# EAGLE design Grove - Dry-Reed Relay v1.0b (EAGLE 6.3)
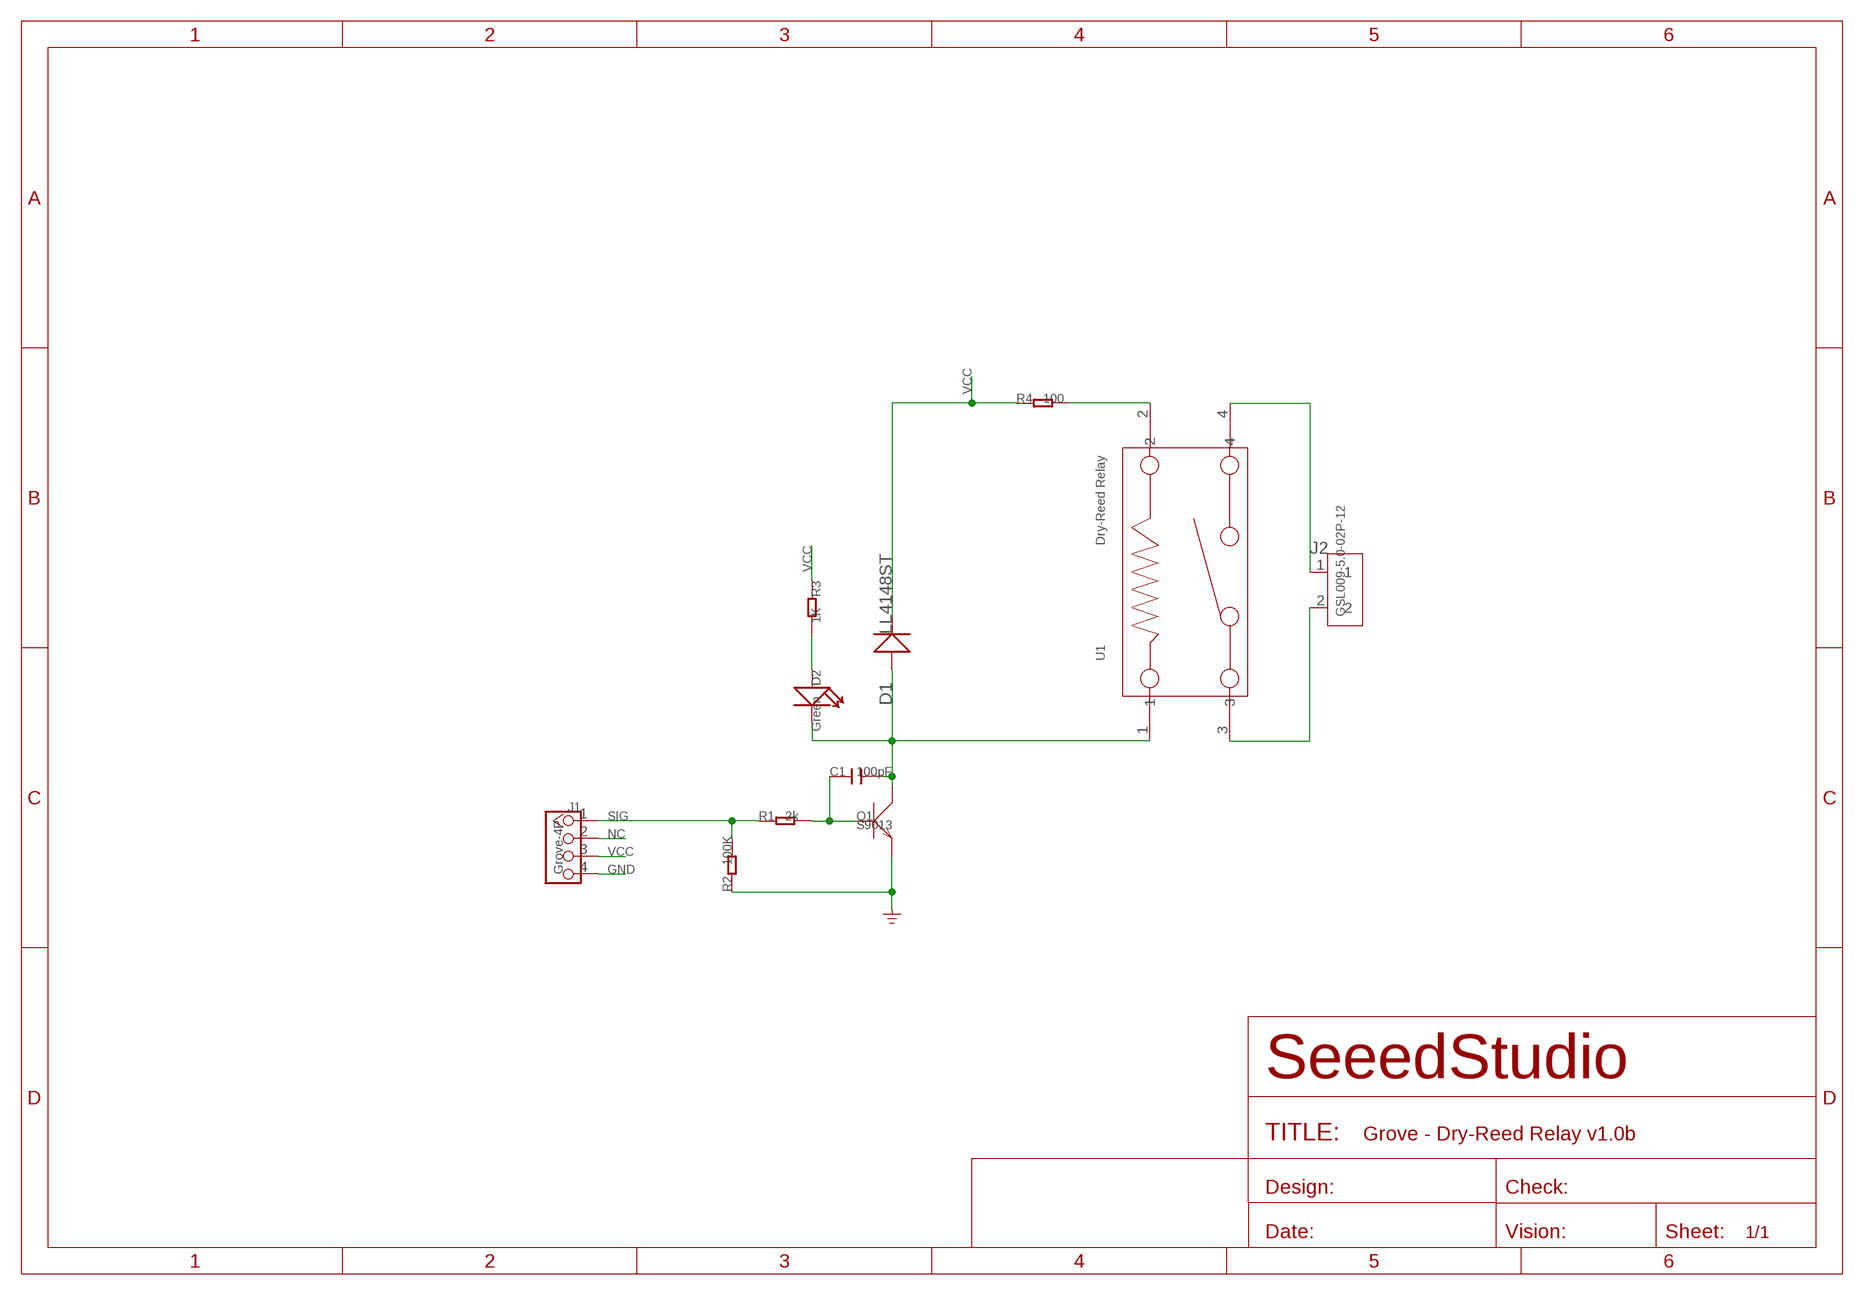
[diagram p0: schematic, sheet 1]

## Parts
C1  100pF  C-0603  [C0603]
D1  LL4148ST  D'1N4148-SMD'  [DO-35-SMD]
D2  Green  LED'0603'  [LED-0603]
J1  Grove-4P  TWIG-4P-2.0-2.0  [4P-2.0]
J2  GSL009-5.0-02P-12  SCREW-TERMINAL-2P'5.08'  [2P-5.08]
Q1  S9013  TRANSISTOR-NPN-SOT23  [SOT23]
R1  2k  R-0603  [R0603]
R2  100K  R-0603  [R0603]
R3  1K  R-0603  [R0603]
R4  100  R-0603  [R0603]
U1  Dry-Reed Relay  RELAY-BR'BR-500R-H-5VDC'  [4P-25.2X8X9H]

## Nets
GND: J1.4 Q1.2(E) R2.1
N$1: C1.1 Q1.1(B) R1.2
N$2: D2.+ R3.2
N$3: C1.2 D1.A(+) D2.- Q1.3(C) U1.1
N$4: J2.1 U1.4
N$6: J2.2 U1.3
N$7: R4.2 U1.2
NC: J1.2
SIG: J1.1 R1.1 R2.2
VCC: D1.C(-) J1.3 R3.1 R4.1

## Library data of the parts
C1 = Discrete:C*: Ceramic Capacitors
D1 = Discrete:D*
D2 = Discrete:LED*
J1 = Connector:TWIG-4P-2.0
J2 = Connector:SCREW-TERMINAL-2P
Q1 = Discrete:TRANSISTOR-NPN*: NPN audion
R1-R4 = Discrete:R*
U1 = template:RELAY-BR: • Small size, light weight and low cost • Application: Mainly use in Cordless Phone, Answering Machine and Security Alarm System etc.… • UL File No.E147052

## Board
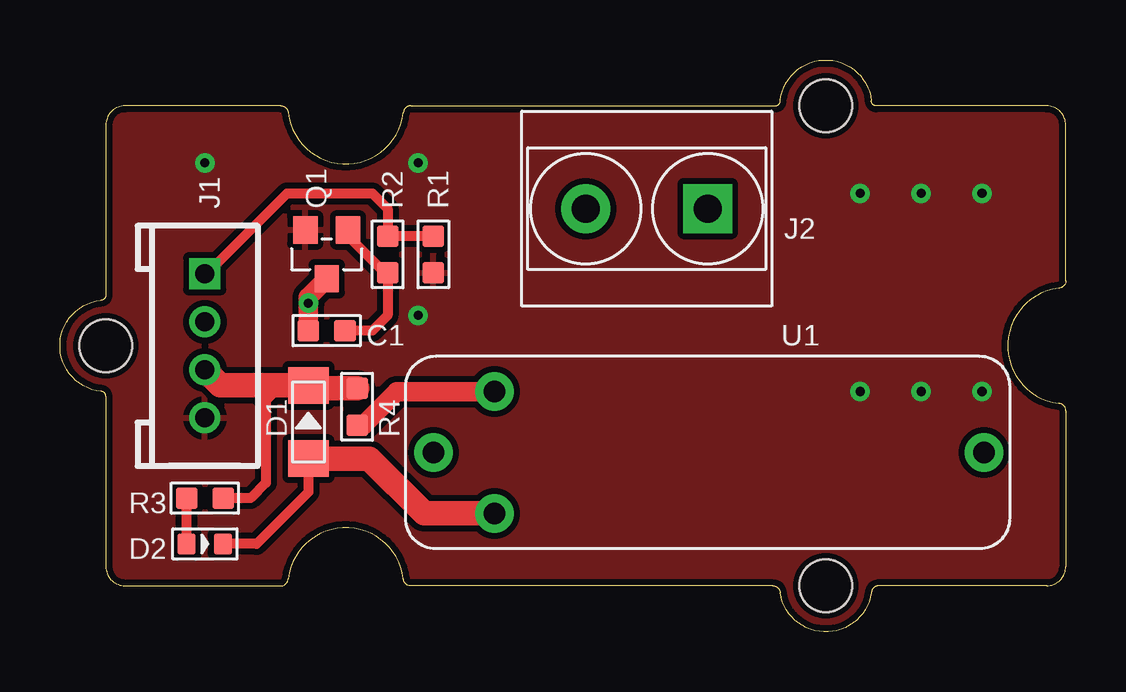
[diagram p1: board, top side]
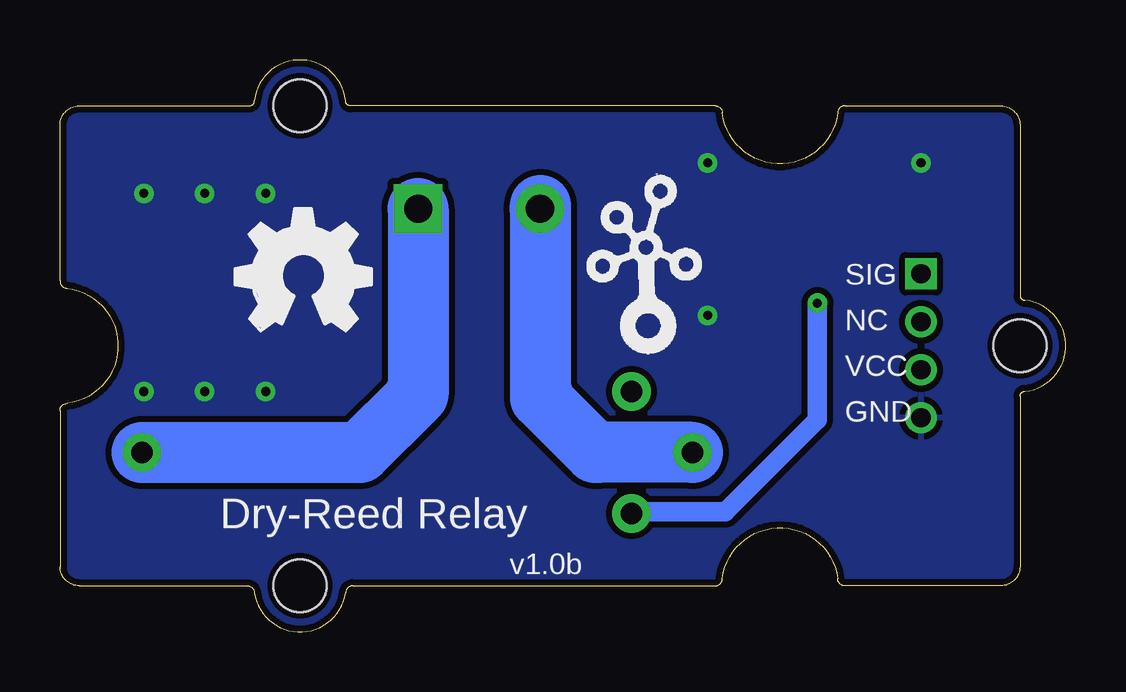
[diagram p2: board, bottom side, seen from below]

Size 41.91 x 23.83 mm. Coordinates in mm from the lower left corner, seen from the top.
Copper layers (1*16): Top 0.035mm / dielectric 1.5mm / Bottom 0.035mm
Design rules "SeeedStudio_rule_no_angle_090911": minimum track width 6mil, minimum drill 12mil, track to track 6mil, track to pad 6mil, pad to pad 6mil, via to via 6mil, smd to smd 0mil, copper to edge 10mil, drill to drill 10mil, minimum pad ring 10mil, minimum via ring 6mil, stop-mask expansion 2mil, vias tented up to drill 25mil, thermal gap 10mil

### Footprints (pad centres in the part's own frame; a part is rotated, then mirrored left to right if it is on the bottom)
C0603 = smd 0.889 x 0.889: 1 -0.762,0; 2 0.762,0
DO-35-SMD = smd 1.524 x 1.676: A -1.524,0; C 1.524,0
LED-0603 = smd 0.762 x 0.889: + -0.762,0; - 0.762,0
4P-2.0 = drill 0.8 pad 1.27 square: 1 -3,0 | drill 0.8 pad 1.27: 2 -1,0; 3 1,0; 4 3,0
2P-5.08 = drill 1.168 pad 2.032 square: 1 0,2.54 | drill 1.168 pad 2.032: 2 0,-2.54
SOT23 = smd 1.016 x 1.143: 1 -0.889,-1.016; 2 0.889,-1.016; 3 0,1.016
R0603 = smd 0.889 x 0.889: 1 -0.762,0; 2 0.762,0
4P-25.2X8X9H = drill 0.9 pad 1.6: 1 -8.89,-2.54; 2 -8.89,2.54; 3 -11.43,0; 4 11.51,0
2U-DIM-W/DRILL = hole 2.2: -10,-10; -10,10; 20,0

### Placement (x,y rotation side)
C1  11.11,12.56 180 top
D1  10.35,8.75 90 top
D2  6.03,3.67 0 top
J1  6.03,11.92 270 top
J2  24.45,17.64 270 top
Q1  11.11,15.73 180 top
R1  13.65,15.73 270 top
R2  15.56,15.73 90 top
R3  6.03,5.57 180 top
R4  12.38,9.38 270 top
U1  26.99,7.48 0 top
U$3  [2U-DIM-W/DRILL]  21.91,11.92 180 top
U$4  [OSHW_FILLX200_NOTEXT]  34.61,12.56 0 bottom
U$5  [TWIGLOGO]  17.46,12.56 0 bottom

### Tracks (layer width: path | path; a pad name or v marks a point on that pad's centre or on a via)
GND  (via drill 0.38 pad 0.81)
  other vias: 38.42,18.27 33.34,18.27 35.88,18.27 35.88,10.02 33.34,10.02 38.42,10.02 14.92,13.19 14.92,19.54 6.03,19.54
  pour Top (isolate 0.254): -0.32,-0.27 42.23,-0.14 42.23,23.99 -0.32,23.99
  pour Bottom (isolate 0.254): -0.32,-0.27 42.23,-0.27 42.23,23.86 -0.32,23.86
N$1
  Top 0.406: R1.2 13.65,14.84 | 13.65,14.84 13.65,13.19 13.02,12.56 C1.1 | Q1.1 12,16.49 13.65,14.84
N$2
  Top 0.406: D2.+ R3.2
N$3  (via drill 0.38 pad 0.81)
  Top 0.406: 10.48,7.22 10.35,7.1 10.35,5.83 8.19,3.67 D2.-
  Top 0.813: Q1.3 10.35,13.95 C1.2 v10.35,13.7
  Top 1.016: D1.A 10.48,7.22 12.89,7.22 15.18,4.94 U1.1
  Bottom 0.813: v10.35,13.7 10.35,8.83 14.19,5 18.04,5 U1.1
N$4
  Bottom 2.184: J2.1 26.99,9.76 28.77,7.98 29.15,7.98 29.78,7.35 38.04,7.35 38.29,7.6
  Bottom 2.54: 26.99,10.02 26.99,9.89 | U1.4 29.4,7.48 27.12,9.76 27.12,9.89 26.99,10.02 | J2.1 26.99,10.02
N$6
  Bottom 2.184: J2.2 21.91,10.27 21.65,10.02 21.65,9.64 19.5,7.48 | U1.3 15.43,7.6
  Bottom 2.54: U1.3 19.5,7.48 19.62,7.48 21.88,9.74 21.88,17.76 J2.2
N$7
  Top 0.813: R4.2 12.64,8.62 14.03,10.02 U1.2
SIG
  Top 0.406: R2.2 R1.1 13.65,17.64 13.02,18.27 9.46,18.27 6.11,14.92 J1.1
VCC
  Top 0.406: 8.57,9.64 8.57,10.27 | 8.57,9.64 8.07,10.14 | 8.57,9.64 8.95,10.02 | 8.57,9.64 8.57,6.21 7.94,5.57 R3.1
  Top 1.016: R4.1 10.48,10.14 D1.C 8.57,10.27 6.68,10.27 J1.3

### Text on the board
bPlace: SIG | NC | VCC | GND | Dry-Reed Relay | v1.0b